# EAGLE schematic P1R5 (EAGLE 7.2.0)
DATABASE: E:/git/clay/Eagle/clayParts_bom-ex.txt

## Sheet 1 of 6
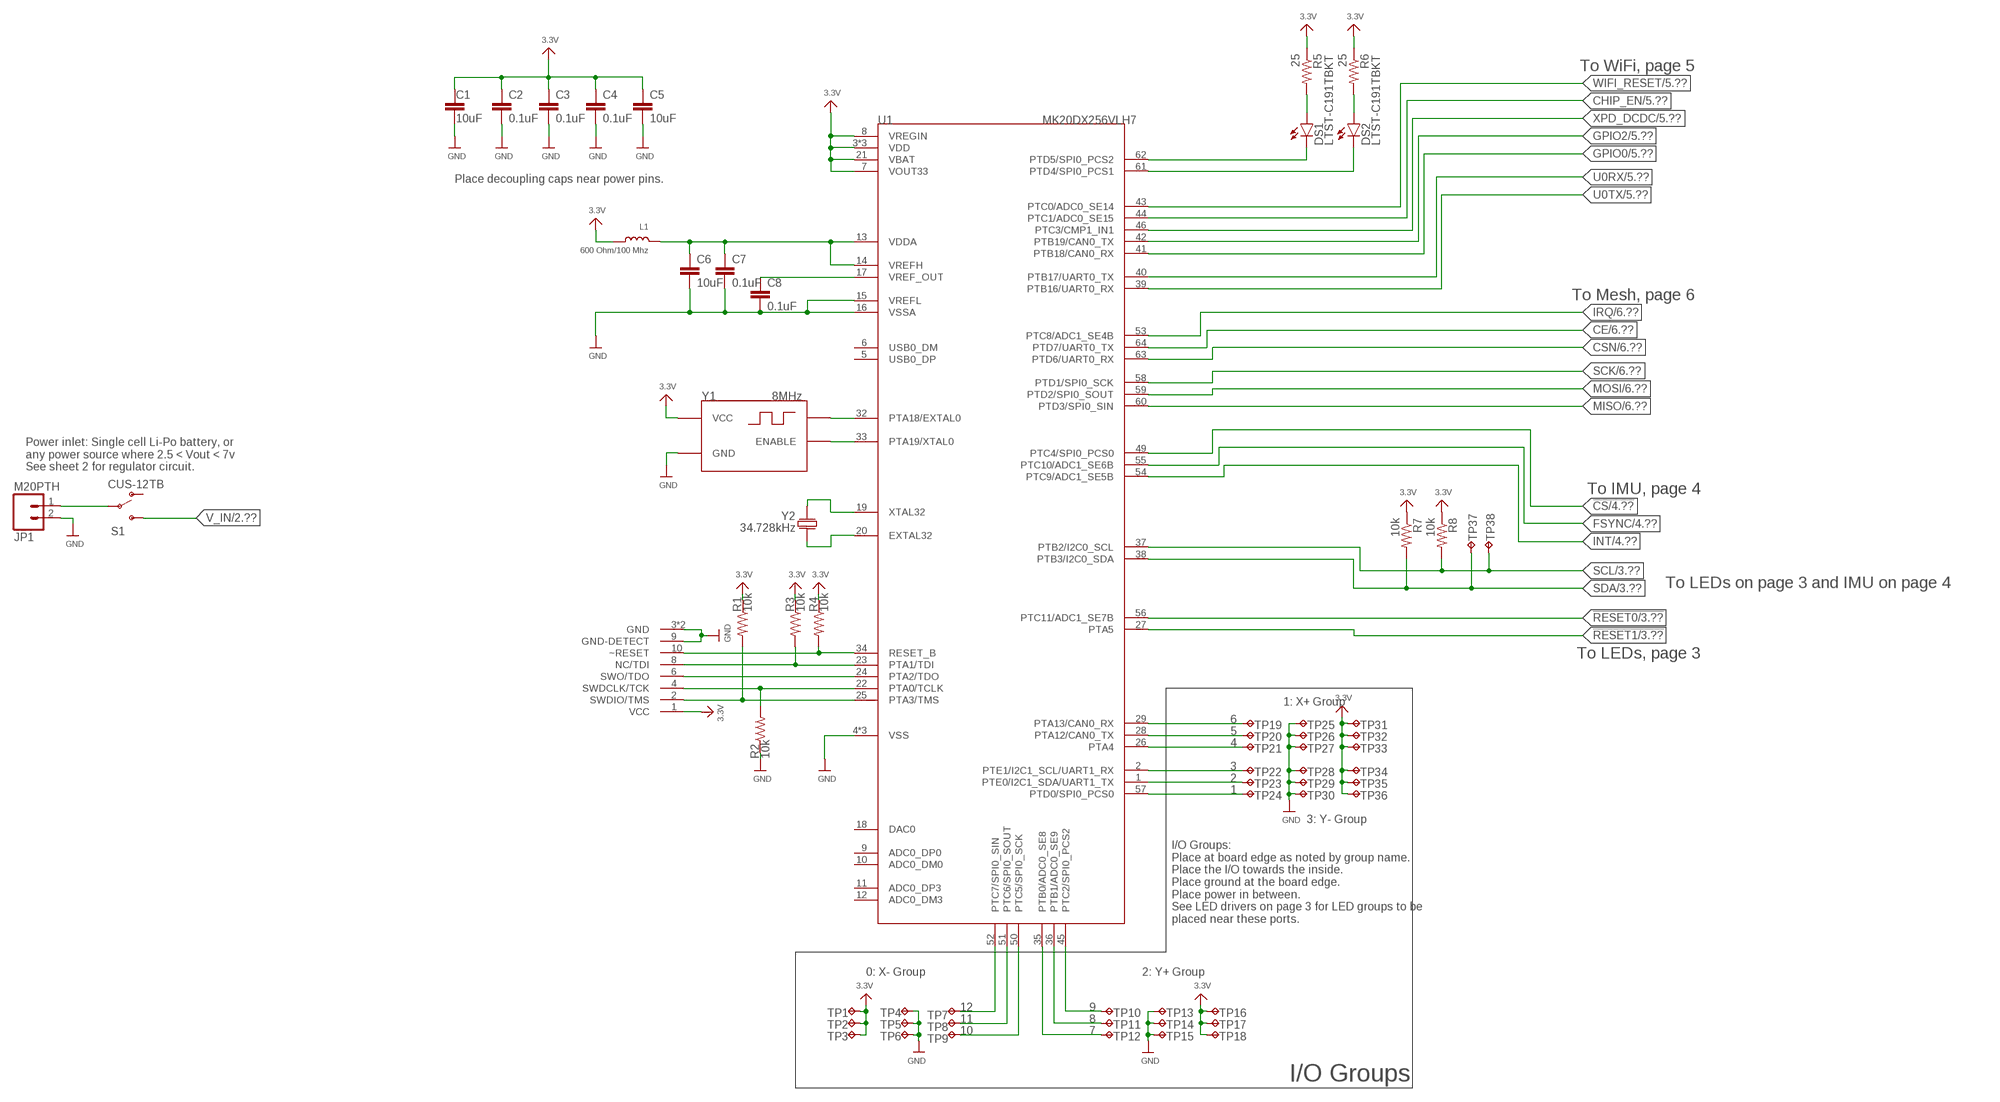
[diagram p0: schematic, sheet 1]

### Parts
C1  10uF  CAP0603-CAP  [0603-CAP]
C2  0.1uF  CAP0402-CAP  [0402-CAP]
C3  0.1uF  CAP0402-CAP  [0402-CAP]
C4  0.1uF  CAP0402-CAP  [0402-CAP]
C5  10uF  CAP0603-CAP  [0603-CAP]
C6  10uF  CAP0603-CAP  [0603-CAP]
C7  0.1uF  CAP0402-CAP  [0402-CAP]
C8  0.1uF  CAP0402-CAP  [0402-CAP]
DS1  LTST-C191TBKT  LED-GREEN  [LED-0603]
DS2  LTST-C191TBKT  LED-GREEN  [LED-0603]
J1  2X5_0.05"_CORTEX_DEBUGTH_NOKEY_UNSHROUDED  [2X5_0.05"_TH_NS]
JP1  M20PTH  M02PTH  [JST_2PIN]
L1  600 Ohm/100 Mhz  INDUCTOR-BK2125HM601-T  [0805]
R1  10k  RESISTOR0402  [_0402]
R2  10k  RESISTOR0402  [_0402]
R3  10k  RESISTOR0402  [_0402]
R4  10k  RESISTOR0402  [_0402]
R5  25  RESISTOR0402  [_0402]
R6  25  RESISTOR0402  [_0402]
R7  10k  RESISTOR0402  [_0402]
R8  10k  RESISTOR0402  [_0402]
S1  CUS-12TB  SWITCH-SPDT-SMD-A  [SWITCH-SPST-SMD-A]
TP1  TPPAD1-13  [P1-13]
TP2  TPPAD1-13  [P1-13]
TP3  TPPAD1-13  [P1-13]
TP4  TPPAD1-13  [P1-13]
TP5  TPPAD1-13  [P1-13]
TP6  TPPAD1-13  [P1-13]
TP7  TPPAD1-13  [P1-13]
TP8  TPPAD1-13  [P1-13]
TP9  TPPAD1-13  [P1-13]
TP10  TPPAD1-13  [P1-13]
TP11  TPPAD1-13  [P1-13]
TP12  TPPAD1-13  [P1-13]
TP13  TPPAD1-13  [P1-13]
TP14  TPPAD1-13  [P1-13]
TP15  TPPAD1-13  [P1-13]
TP16  TPPAD1-13  [P1-13]
TP17  TPPAD1-13  [P1-13]
TP18  TPPAD1-13  [P1-13]
TP19  TPPAD1-13  [P1-13]
TP20  TPPAD1-13  [P1-13]
TP21  TPPAD1-13  [P1-13]
TP22  TPPAD1-13  [P1-13]
TP23  TPPAD1-13  [P1-13]
TP24  TPPAD1-13  [P1-13]
TP25  TPPAD1-13  [P1-13]
TP26  TPPAD1-13  [P1-13]
TP27  TPPAD1-13  [P1-13]
TP28  TPPAD1-13  [P1-13]
TP29  TPPAD1-13  [P1-13]
TP30  TPPAD1-13  [P1-13]
TP31  TPPAD1-13  [P1-13]
TP32  TPPAD1-13  [P1-13]
TP33  TPPAD1-13  [P1-13]
TP34  TPPAD1-13  [P1-13]
TP35  TPPAD1-13  [P1-13]
TP36  TPPAD1-13  [P1-13]
TP37  TPTP08R  [TP08R]
TP38  TPTP08R  [TP08R]
U1  MK20DX256VLH7  [MK20DX256VLH7]
Y1  8MHz  ASCO.063X.047  [ASCO]
Y2  34.728kHz  ABS06ABS06_.079X.047  [ABS06]

### Nets
3.3V: C1.1 C2.1 C3.1 C4.1 C5.1 J1.1(VCC) L1.2 R1.1 R3.1 R4.1 R5.1 R6.1 R7.1 R8.1 TP1.TP TP2.TP TP3.TP TP16.TP TP17.TP TP18.TP TP31.TP TP32.TP TP33.TP TP34.TP TP35.TP TP36.TP U1.3(VDD) U1.7(VOUT33) U1.8(VREGIN) U1.21(VBAT) U1.30(VDD) U1.48(VDD) Y1.VCC ; also sheet 2,3,4,5,6
!CS: U1.49(PTC4/SPI0_PCS0) ; also sheet 4
!RESET0: U1.56(PTC11/ADC1_SE7B) ; also sheet 3
!RESET1: U1.27(PTA5) ; also sheet 3
CE: U1.64(PTD7/UART0_TX) ; also sheet 6
CHIP_EN: U1.44(PTC1/ADC0_SE15) ; also sheet 5
CSN: U1.63(PTD6/UART0_RX) ; also sheet 6
FSYNC: U1.55(PTC10/ADC1_SE6B) ; also sheet 4
GND [Top GND Pour]: C1.2 C2.2 C3.2 C4.2 C5.2 C6.2 C7.2 C8.2 J1.3(GND) J1.5(GND) J1.9(GND-DETECT) JP1.2 R2.1 TP4.TP TP5.TP TP6.TP TP13.TP TP14.TP TP15.TP TP25.TP TP26.TP TP27.TP TP28.TP TP29.TP TP30.TP U1.4(VSS) U1.15(VREFL) U1.16(VSSA) U1.31(VSS) U1.47(VSS) Y1.GND ; also sheet 2,3,4,5,6
GPIO0: U1.41(PTB18/CAN0_RX) ; also sheet 5
GPIO2: U1.42(PTB19/CAN0_TX) ; also sheet 5
INT: U1.54(PTC9/ADC1_SE5B) ; also sheet 4
IRQ: U1.53(PTC8/ADC1_SE4B) ; also sheet 6
MISO: U1.60(PTD3/SPI0_SIN) ; also sheet 6
MOSI: U1.59(PTD2/SPI0_SOUT) ; also sheet 6
N$1: U1.32(PTA18/EXTAL0) Y1.OUT
N$2: U1.33(PTA19/XTAL0) Y1.ENABLE
N$5: TP7.TP U1.52(PTC7/SPI0_SIN)
N$6: TP8.TP U1.51(PTC6/SPI0_SOUT)
N$7: DS1.A R5.2
N$8: U1.19(XTAL32) Y2.P$2
N$9: U1.20(EXTAL32) Y2.P$1
N$10: DS1.C U1.62(PTD5/SPI0_PCS2)
N$11: TP9.TP U1.50(PTC5/SPI0_SCK)
N$12: TP10.TP U1.45(PTC2/SPI0_PCS2)
N$13: DS2.C U1.61(PTD4/SPI0_PCS1)
N$14: TP11.TP U1.36(PTB1/ADC0_SE9)
N$15: TP12.TP U1.35(PTB0/ADC0_SE8)
N$16: TP24.TP U1.57(PTD0/SPI0_PCS0)
N$17: TP21.TP U1.26(PTA4)
N$18: TP22.TP U1.2(PTE1/I2C1_SCL/UART1_RX)
N$19: TP23.TP U1.1(PTE0/I2C1_SDA/UART1_TX)
N$20: TP19.TP U1.29(PTA13/CAN0_RX)
N$21: TP20.TP U1.28(PTA12/CAN0_TX)
N$29: DS2.A R6.2
N$104: JP1.1 S1.2(P)
PTA0: J1.4(SWDCLK/TCK) R2.2 U1.22(PTA0/TCLK)
PTA1: J1.8(NC/TDI) R3.2 U1.23(PTA1/TDI)
PTA2: J1.6(SWO/TDO) U1.24(PTA2/TDO)
PTA3: J1.2(SWDIO/TMS) R1.2 U1.25(PTA3/TMS)
RESET_B: J1.10(~RESET) R4.2 U1.34(RESET_B)
SCK: U1.58(PTD1/SPI0_SCK) ; also sheet 6
SCL: R8.2 TP38.TP U1.37(PTB2/I2C0_SCL) ; also sheet 3,4
SDA: R7.2 TP37.TP U1.38(PTB3/I2C0_SDA) ; also sheet 3,4
U0RX: U1.40(PTB17/UART0_TX) ; also sheet 5
U0TX: U1.39(PTB16/UART0_RX) ; also sheet 5
V_IN [Top GND Pour]: S1.3(S) ; also sheet 2
VDDA: C6.1 C7.1 L1.1 U1.13(VDDA) U1.14(VREFH)
VREF_OUT: C8.1 U1.17(VREF_OUT)
WIFI_RESET: U1.43(PTC0/ADC0_SE14) ; also sheet 5
XPD_DCDC: U1.46(PTC3/CMP1_IN1) ; also sheet 5
Unconnected: S1.1(O) U1.5(USB0_DP) U1.6(USB0_DM) U1.9(ADC0_DP0) U1.10(ADC0_DM0) U1.11(ADC0_DP3) U1.12(ADC0_DM3) U1.18(DAC0)

### Notes on the sheet
- To WiFi, page 5
- Place decoupling caps near power pins.
- To Mesh, page 6
- Power inlet: Single cell Li-Po battery, or 
  any power source where 2.5 < Vout < 7v
  See sheet 2 for regulator circuit.
- To IMU, page 4
- To LEDs on page 3 and IMU on page 4
- To LEDs, page 3
- 1: X+ Group
- 6
- 5
- 4
- 3
- 2
- 1
- 3: Y- Group
- I/O Groups:
  Place at board edge as noted by group name.
  Place the I/O towards the inside.
  Place ground at the board edge.
  Place power in between.
  See LED drivers on page 3 for LED groups to be 
  placed near these ports.
- 0: X- Group | 2: Y+ Group
- 12 | 9
- 11 | 8
- 10 | 7
- I/O Groups

## Sheet 2 of 6
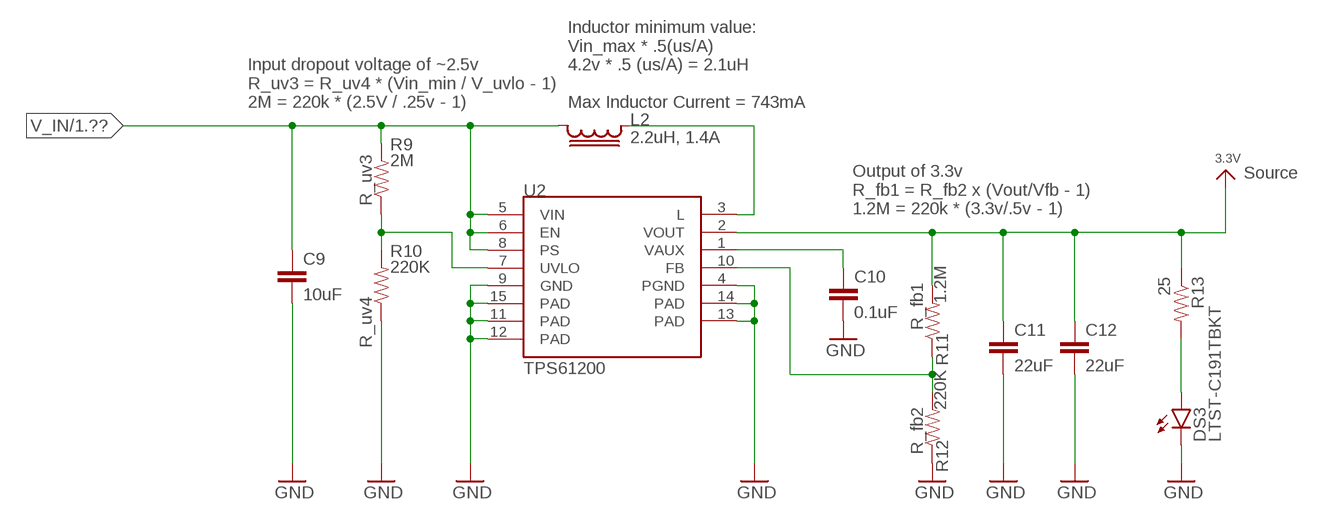
[diagram p1: schematic, sheet 2]

### Parts
C9  10uF  CAP0603-CAP  [0603-CAP]
C10  0.1uF  CAP0402-CAP  [0402-CAP]
C11  22uF  CAP1210  [1210]
C12  22uF  CAP1210  [1210]
DS3  LTST-C191TBKT  LED-GREEN  [LED-0603]
L2  2.2uH, 1.4A  LPS30152.2UH  [LPS3015]
R9  2M  RESISTOR0402  [_0402]
R10  220K  RESISTOR0402  [_0402]
R11  1.2M  RESISTOR0402  [_0402]
R12  220K  RESISTOR0402  [_0402]
R13  25  RESISTOR0402  [_0402]
U2  TPS61200  [QFN-10_PAD]

### Nets
3.3V: C11.1 C12.1 R11.2 R13.1 U2.2(VOUT) ; also sheet 1,3,4,5,6
GND [Top GND Pour]: C9.2 C10.2 C11.2 C12.2 DS3.C R10.1 R12.1 U2.4(PGND) U2.9(GND) U2.11(PAD) U2.12(PAD) U2.13(PAD) U2.14(PAD) U2.15(PAD) ; also sheet 1,3,4,5,6
N$24 [Top GND Pour]: L2.1 U2.3(L)
N$25: C10.1 U2.1(VAUX)
N$26: R9.1 R10.2 U2.7(UVLO)
N$27: R11.1 R12.2 U2.10(FB)
N$28: DS3.A R13.2
V_IN [Top GND Pour]: C9.1 L2.2 R9.2 U2.5(VIN) U2.6(EN) U2.8(PS) ; also sheet 1

### Notes on the sheet
- Input dropout voltage of ~2.5v
  R_uv3 = R_uv4 * (Vin_min / V_uvlo - 1)
  2M = 220k * (2.5V / .25v - 1)
- Inductor minimum value:
  Vin_max * .5(us/A)
  4.2v * .5 (us/A) = 2.1uH
  
  Max Inductor Current = 743mA
- Source
- R_uv3
- Output of 3.3v
  R_fb1 = R_fb2 x (Vout/Vfb - 1)
  1.2M = 220k * (3.3v/.5v - 1)
- R_fb1
- R_uv4
- R_fb2

## Sheet 3 of 6
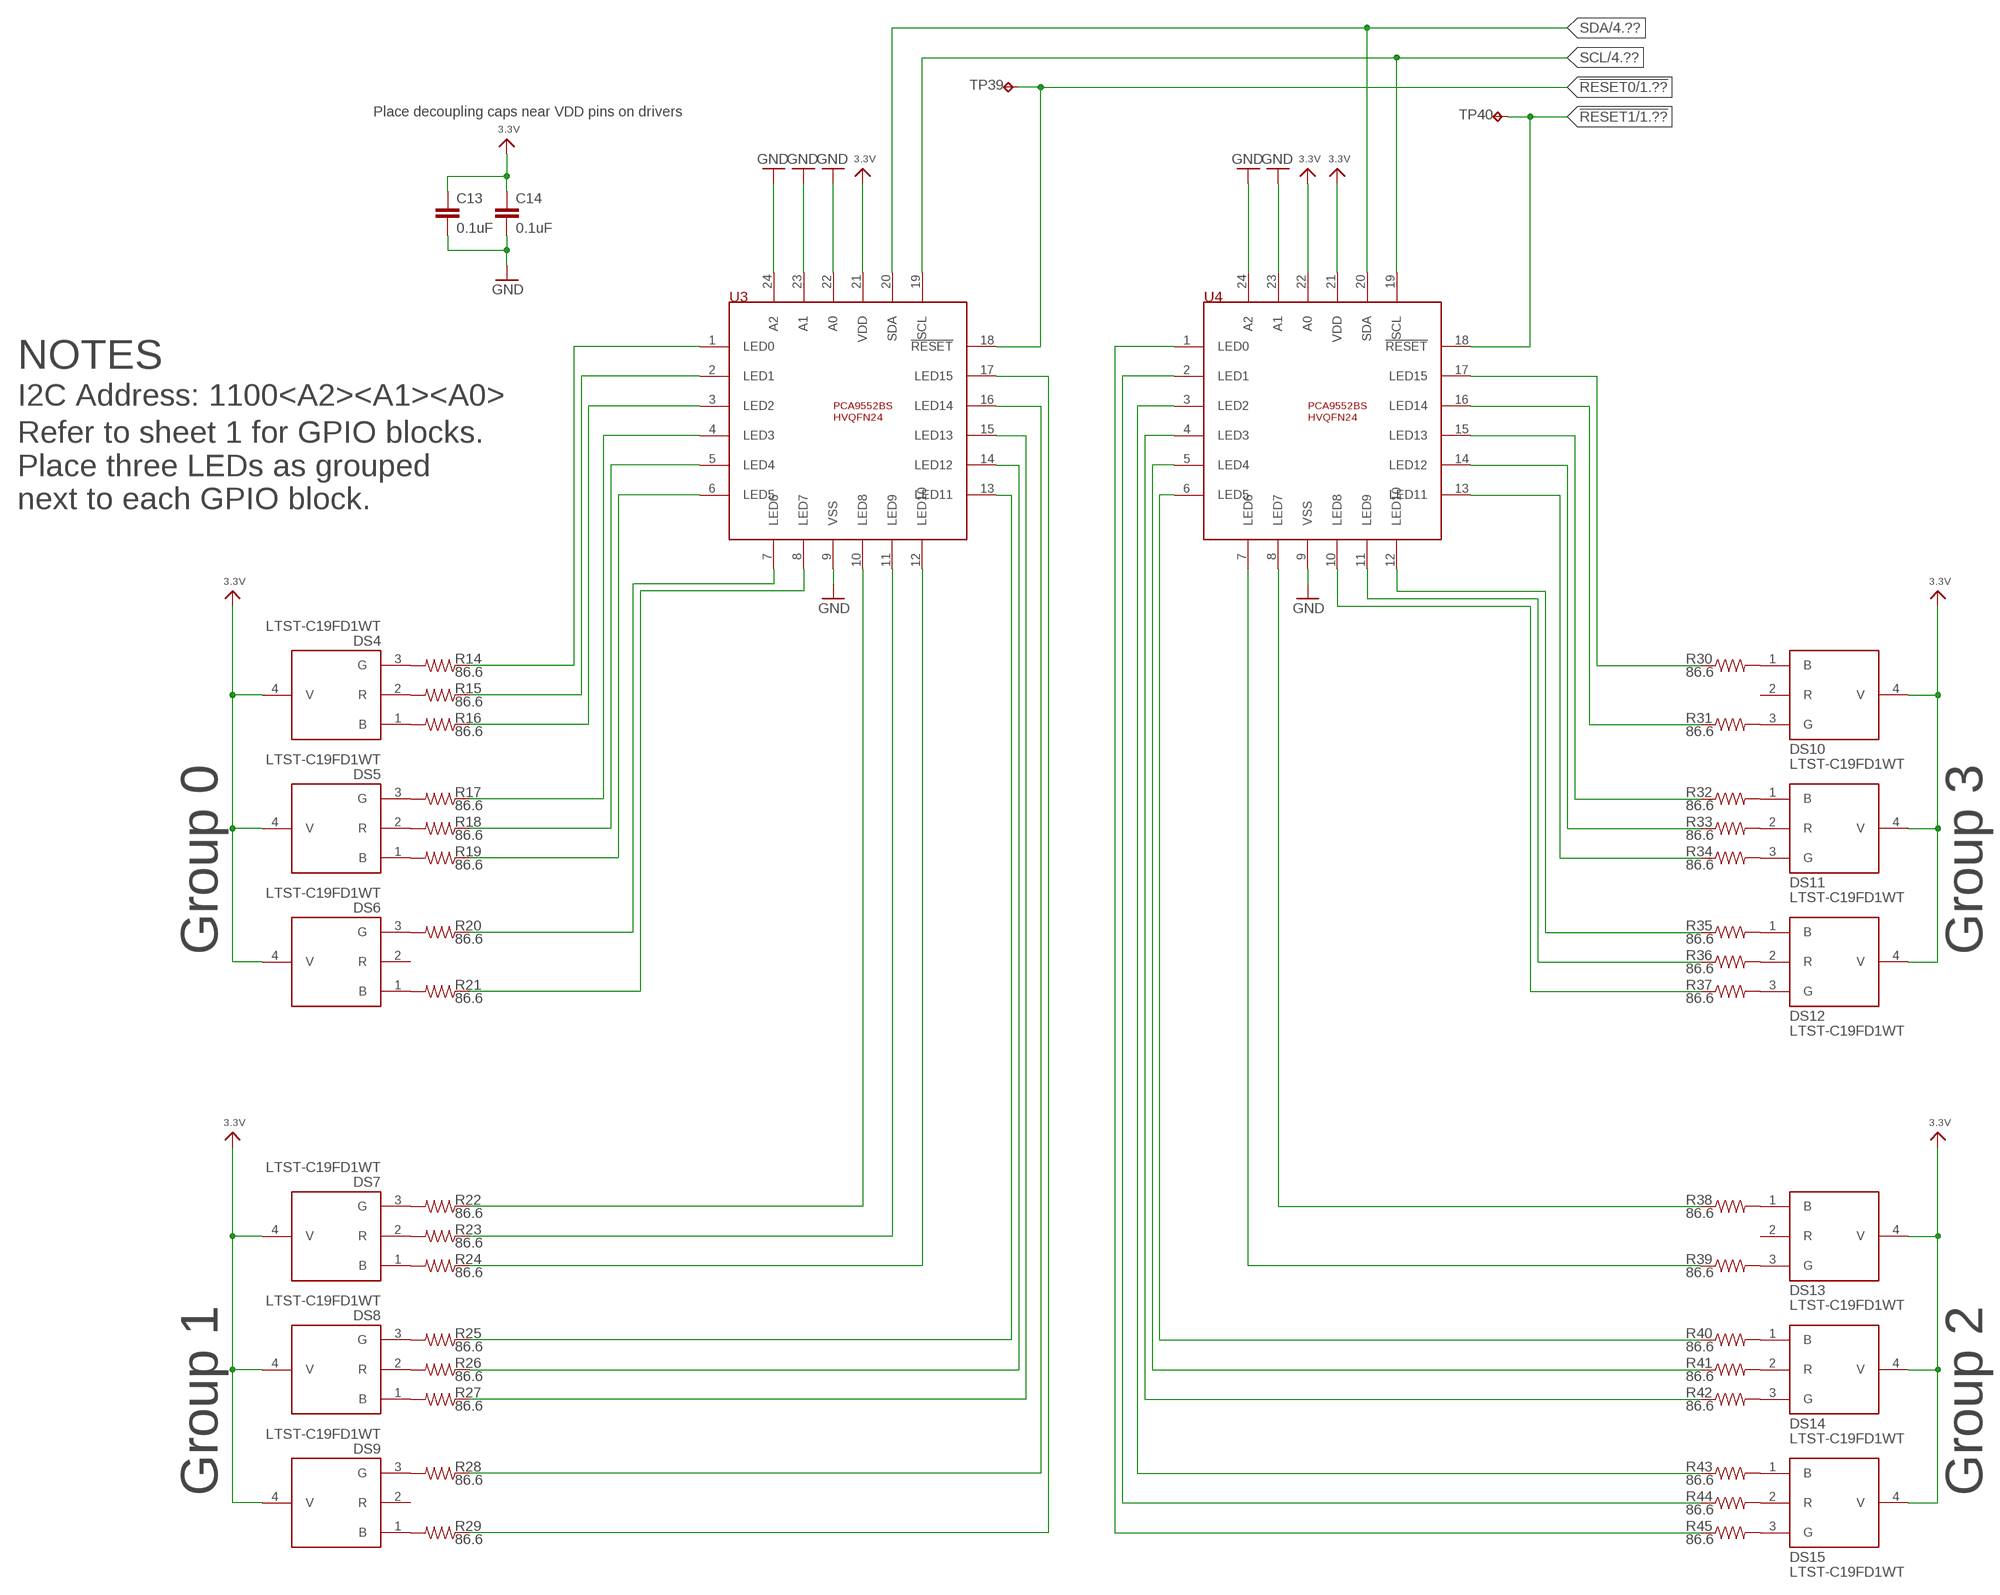
[diagram p2: schematic, sheet 3]

### Parts
C13  0.1uF  CAP0402-CAP  [0402-CAP]
C14  0.1uF  CAP0402-CAP  [0402-CAP]
DS4  LTST-C19FD1WT  [LTST-C19FD1WT]
DS5  LTST-C19FD1WT  [LTST-C19FD1WT]
DS6  LTST-C19FD1WT  [LTST-C19FD1WT]
DS7  LTST-C19FD1WT  [LTST-C19FD1WT]
DS8  LTST-C19FD1WT  [LTST-C19FD1WT]
DS9  LTST-C19FD1WT  [LTST-C19FD1WT]
DS10  LTST-C19FD1WT  [LTST-C19FD1WT]
DS11  LTST-C19FD1WT  [LTST-C19FD1WT]
DS12  LTST-C19FD1WT  [LTST-C19FD1WT]
DS13  LTST-C19FD1WT  [LTST-C19FD1WT]
DS14  LTST-C19FD1WT  [LTST-C19FD1WT]
DS15  LTST-C19FD1WT  [LTST-C19FD1WT]
R14  86.6  RESISTOR0402  [_0402]
R15  86.6  RESISTOR0402  [_0402]
R16  86.6  RESISTOR0402  [_0402]
R17  86.6  RESISTOR0402  [_0402]
R18  86.6  RESISTOR0402  [_0402]
R19  86.6  RESISTOR0402  [_0402]
R20  86.6  RESISTOR0402  [_0402]
R21  86.6  RESISTOR0402  [_0402]
R22  86.6  RESISTOR0402  [_0402]
R23  86.6  RESISTOR0402  [_0402]
R24  86.6  RESISTOR0402  [_0402]
R25  86.6  RESISTOR0402  [_0402]
R26  86.6  RESISTOR0402  [_0402]
R27  86.6  RESISTOR0402  [_0402]
R28  86.6  RESISTOR0402  [_0402]
R29  86.6  RESISTOR0402  [_0402]
R30  86.6  RESISTOR0402  [_0402]
R31  86.6  RESISTOR0402  [_0402]
R32  86.6  RESISTOR0402  [_0402]
R33  86.6  RESISTOR0402  [_0402]
R34  86.6  RESISTOR0402  [_0402]
R35  86.6  RESISTOR0402  [_0402]
R36  86.6  RESISTOR0402  [_0402]
R37  86.6  RESISTOR0402  [_0402]
R38  86.6  RESISTOR0402  [_0402]
R39  86.6  RESISTOR0402  [_0402]
R40  86.6  RESISTOR0402  [_0402]
R41  86.6  RESISTOR0402  [_0402]
R42  86.6  RESISTOR0402  [_0402]
R43  86.6  RESISTOR0402  [_0402]
R44  86.6  RESISTOR0402  [_0402]
R45  86.6  RESISTOR0402  [_0402]
TP39  TPTP08R  [TP08R]
TP40  TPTP08R  [TP08R]
U3  PCA9552BS  [HVQFN24]
U4  PCA9552BS  [HVQFN24]

### Nets
3.3V: C13.1 C14.1 DS4.4(V) DS5.4(V) DS6.4(V) DS7.4(V) DS8.4(V) DS9.4(V) DS10.4(V) DS11.4(V) DS12.4(V) DS13.4(V) DS14.4(V) DS15.4(V) U3.21(VDD) U4.21(VDD) U4.22(A0) ; also sheet 1,2,4,5,6
!RESET0: TP39.TP U3.18(!RESET) ; also sheet 1
!RESET1: TP40.TP U4.18(!RESET) ; also sheet 1
GND [Top GND Pour]: C13.2 C14.2 U3.9(VSS) U3.22(A0) U3.23(A1) U3.24(A2) U4.9(VSS) U4.23(A1) U4.24(A2) ; also sheet 1,2,4,5,6
N$36: DS8.2(R) R26.2
N$37: DS7.2(R) R23.2
N$38: DS7.1(B) R24.2
N$39: DS7.3(G) R22.2
N$40: DS8.1(B) R27.2
N$41: DS8.3(G) R25.2
N$42: DS10.3(G) R31.2
N$43: DS10.1(B) R30.2
N$44: DS9.1(B) R29.2
N$45: DS9.3(G) R28.2
N$46: R14.1 U3.1(LED0)
N$47: DS5.2(R) R18.2
N$48: R15.1 U3.2(LED1)
N$49: R16.1 U3.3(LED2)
N$50: DS14.1(B) R40.2
N$51: DS4.2(R) R15.2
N$52: DS11.2(R) R33.2
N$53: DS4.1(B) R16.2
N$54: DS4.3(G) R14.2
N$55: DS5.1(B) R19.2
N$56: DS5.3(G) R17.2
N$57: DS15.3(G) R45.2
N$58: DS12.1(B) R35.2
N$59: DS13.3(G) R39.2
N$60: R17.1 U3.4(LED3)
N$61: DS11.3(G) R34.2
N$62: DS14.3(G) R42.2
N$63: DS11.1(B) R32.2
N$64: DS12.3(G) R37.2
N$65: DS6.1(B) R21.2
N$66: DS6.3(G) R20.2
N$67: DS14.2(R) R41.2
N$68: DS13.1(B) R38.2
N$69: R18.1 U3.5(LED4)
N$70: DS15.1(B) R43.2
N$71: R19.1 U3.6(LED5)
N$72: R20.1 U3.7(LED6)
N$73: R21.1 U3.8(LED7)
N$74: R22.1 U3.10(LED8)
N$75: R23.1 U3.11(LED9)
N$76: R24.1 U3.12(LED10)
N$77: R25.1 U3.13(LED11)
N$78: R26.1 U3.14(LED12)
N$79: R27.1 U3.15(LED13)
N$80: R28.1 U3.16(LED14)
N$81: R29.1 U3.17(LED15)
N$82: DS12.2(R) R36.2
N$83: DS15.2(R) R44.2
N$84: R30.1 U4.17(LED15)
N$85: R31.1 U4.16(LED14)
N$86: R32.1 U4.15(LED13)
N$87: R33.1 U4.14(LED12)
N$88: R34.1 U4.13(LED11)
N$89: R35.1 U4.12(LED10)
N$90: R36.1 U4.11(LED9)
N$91: R37.1 U4.10(LED8)
N$92: R38.1 U4.8(LED7)
N$93: R39.1 U4.7(LED6)
N$94: R40.1 U4.6(LED5)
N$95: R41.1 U4.5(LED4)
N$96: R42.1 U4.4(LED3)
N$97: R43.1 U4.3(LED2)
N$98: R44.1 U4.2(LED1)
N$99: R45.1 U4.1(LED0)
SCL: U3.19(SCL) U4.19(SCL) ; also sheet 1,4
SDA: U3.20(SDA) U4.20(SDA) ; also sheet 1,4
Unconnected: DS6.2(R) DS9.2(R) DS10.2(R) DS13.2(R)

### Notes on the sheet
- Place decoupling caps near VDD pins on drivers
- NOTES
- I2C Address: 1100<A2><A1><A0>
- Refer to sheet 1 for GPIO blocks.
  Place three LEDs as grouped 
  next to each GPIO block.
- Group 0 | Group 3
- Group 1 | Group 2

## Sheet 4 of 6
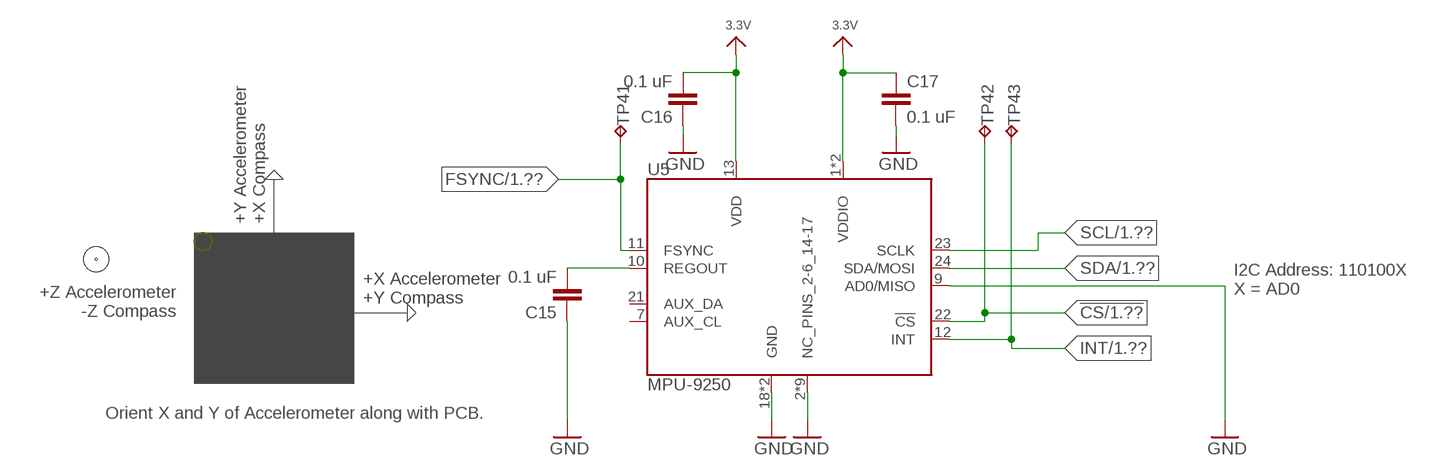
[diagram p3: schematic, sheet 4]

### Parts
C15  0.1 uF  CAP0402-CAP  [0402-CAP]
C16  0.1 uF  CAP0402-CAP  [0402-CAP]
C17  0.1 uF  CAP0402-CAP  [0402-CAP]
TP41  TPTP08R  [TP08R]
TP42  TPTP08R  [TP08R]
TP43  TPTP08R  [TP08R]
U5  MPU-9250  [QFN-24/3MM]

### Nets
3.3V: C16.2 C17.1 U5.1(VDDIO) U5.8(VDDIO) U5.13(VDD) ; also sheet 1,2,3,5,6
!CS: TP42.TP U5.22(!CS) ; also sheet 1
FSYNC: TP41.TP U5.11(FSYNC) ; also sheet 1
GND [Top GND Pour]: C15.1 C16.1 C17.2 U5.2(NC_PINS_2-6_14-17) U5.3(NC_PINS_2-6_14-17) U5.4(NC_PINS_2-6_14-17) U5.5(NC_PINS_2-6_14-17) U5.6(NC_PINS_2-6_14-17) U5.9(AD0/MISO) U5.14(NC_PINS_2-6_14-17) U5.15(NC_PINS_2-6_14-17) U5.16(NC_PINS_2-6_14-17) U5.17(NC_PINS_2-6_14-17) U5.18(GND) U5.20(GND) ; also sheet 1,2,3,5,6
INT: TP43.TP U5.12(INT) ; also sheet 1
N$4: C15.2 U5.10(REGOUT)
SCL: U5.23(SCLK) ; also sheet 1,3
SDA: U5.24(SDA/MOSI) ; also sheet 1,3
Unconnected: U5.7(AUX_CL) U5.21(AUX_DA)

### Notes on the sheet
- +Y Accelerometer
  +X Compass
- +Z Accelerometer
  -Z Compass
- I2C Address: 110100X
  X = AD0
- +X Accelerometer
  +Y Compass
- Orient X and Y of Accelerometer along with PCB.

## Sheet 5 of 6
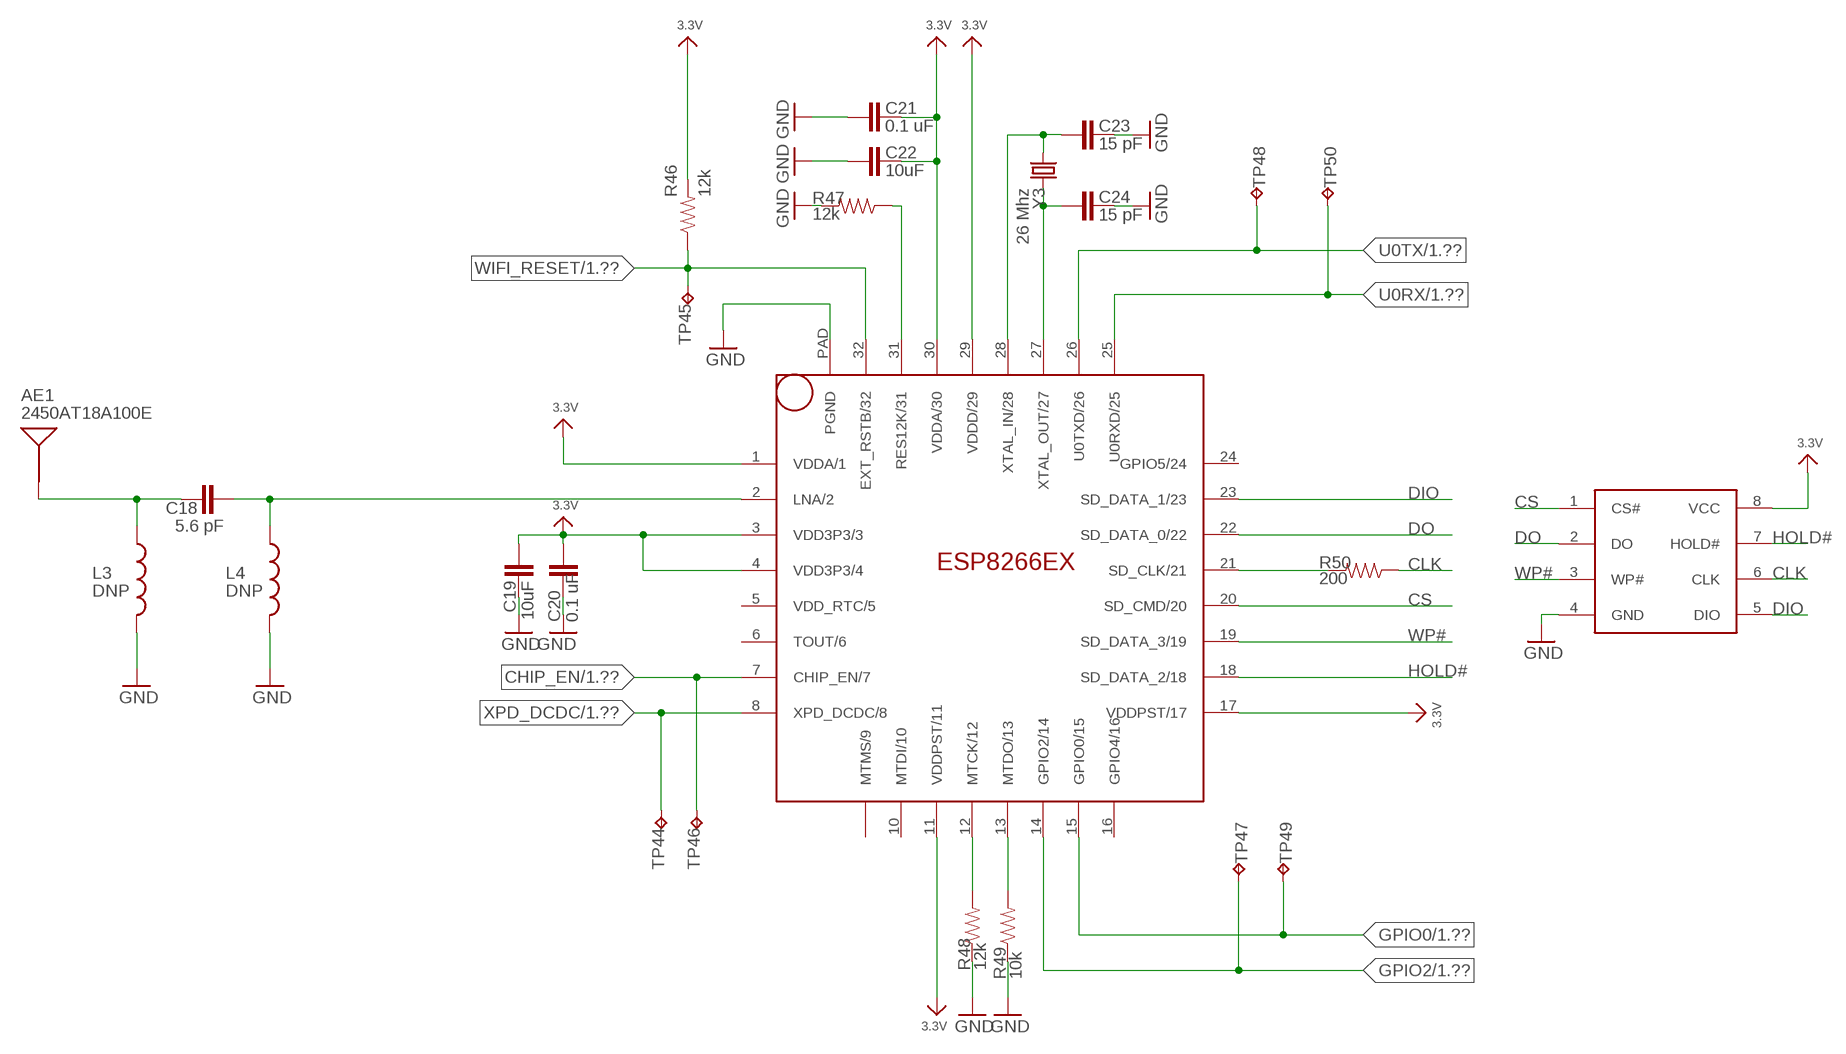
[diagram p4: schematic, sheet 5]

### Parts
AE1  2450AT18A100E  ANTENNA2SMD  [ANTENNA-CHIP2]
C18  5.6 pF  CAP0402-CAP  [0402-CAP]
C19  10uF  CAP0603-CAP  [0603-CAP]
C20  0.1 uF  CAP0402-CAP  [0402-CAP]
C21  0.1 uF  CAP0402-CAP  [0402-CAP]
C22  10uF  CAP0603-CAP  [0603-CAP]
C23  15 pF  CAP0402-CAP  [0402-CAP]
C24  15 pF  CAP0402-CAP  [0402-CAP]
L3  DNP  INDUCTOR30OHM,1.8A  [0603]
L4  DNP  INDUCTOR30OHM,1.8A  [0603]
R46  12k  RESISTOR0402  [_0402]
R47  12k  RESISTOR0402  [_0402]
R48  12k  RESISTOR0402  [_0402]
R49  10k  RESISTOR0402  [_0402]
R50  200  RESISTOR0402  [_0402]
TP44  TPTP08R  [TP08R]
TP45  TPTP08R  [TP08R]
TP46  TPTP08R  [TP08R]
TP47  TPTP08R  [TP08R]
TP48  TPTP08R  [TP08R]
TP49  TPTP08R  [TP08R]
TP50  TPTP08R  [TP08R]
U6  ESP8266EX  [QFN32]
U7  25Q40  [SOP8]
Y3  26 Mhz  CRYSTAL5X3  [CRYSTAL-SMD-5X3]

### Nets
3.3V: C19.1 C20.2 C21.1 C22.1 R46.2 U6.1(VDDA/1) U6.3(VDD3P3/3) U6.4(VDD3P3/4) U6.11(VDDPST/11) U6.17(VDDPST/17) U6.29(VDDD/29) U6.30(VDDA/30) U7.8(VCC) ; also sheet 1,2,3,4,6
CHIP_EN: TP46.TP U6.7(CHIP_EN/7) ; also sheet 1
CLK: R50.1 U7.6(CLK)
CS: U6.20(SD_CMD/20) U7.1(CS#)
DIO: U6.23(SD_DATA_1/23) U7.5(DIO)
DO: U6.22(SD_DATA_0/22) U7.2(DO)
GND [Top GND Pour]: C19.2 C20.1 C21.2 C22.2 C23.2 C24.2 L3.2 L4.2 R47.2 R48.1 R49.1 U6.PAD(PGND) U7.4(GND) ; also sheet 1,2,3,4,6
GPIO0: TP49.TP U6.15(GPIO0/15) ; also sheet 1
GPIO2: TP47.TP U6.14(GPIO2/14) ; also sheet 1
HOLD#: U6.18(SD_DATA_2/18) U7.7(HOLD#)
N$3: R50.2 U6.21(SD_CLK/21)
N$22: C18.2 L4.1 U6.2(LNA/2)
N$23: C24.1 U6.27(XTAL_OUT/27) Y3.1
N$100: C23.1 U6.28(XTAL_IN/28) Y3.3
N$101: AE1.FEED(SIGNAL) C18.1 L3.1
N$102: R48.2 U6.12(MTCK/12)
N$103: R49.2 U6.13(MTDO/13)
N$107: R47.1 U6.31(RES12K/31)
U0RX: TP50.TP U6.25(U0RXD/25) ; also sheet 1
U0TX: TP48.TP U6.26(U0TXD/26) ; also sheet 1
WIFI_RESET: R46.1 TP45.TP U6.32(EXT_RSTB/32) ; also sheet 1
WP#: U6.19(SD_DATA_3/19) U7.3(WP#)
XPD_DCDC: TP44.TP U6.8(XPD_DCDC/8) ; also sheet 1
Unconnected: U6.5(VDD_RTC/5) U6.6(TOUT/6) U6.9(MTMS/9) U6.10(MTDI/10) U6.16(GPIO4/16) U6.24(GPIO5/24)

## Sheet 6 of 6
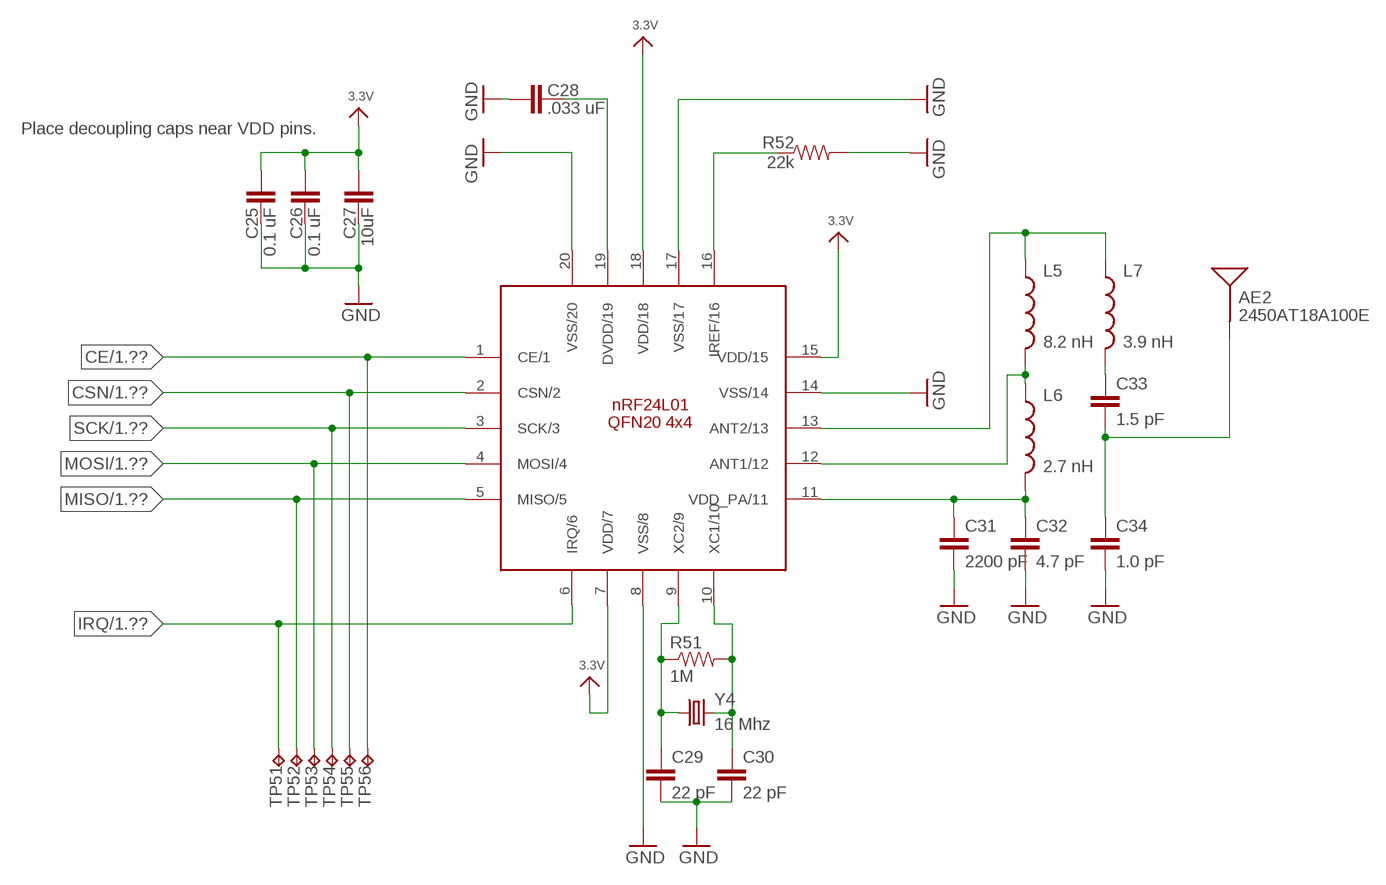
[diagram p5: schematic, sheet 6]

### Parts
AE2  2450AT18A100E  ANTENNA2SMD  [ANTENNA-CHIP2]
C25  0.1 uF  CAP0402-CAP  [0402-CAP]
C26  0.1 uF  CAP0402-CAP  [0402-CAP]
C27  10uF  CAP0603-CAP  [0603-CAP]
C28  .033 uF  CAP0402-CAP  [0402-CAP]
C29  22 pF  CAP0402-CAP  [0402-CAP]
C30  22 pF  CAP0402-CAP  [0402-CAP]
C31  2200 pF  CAP0402-CAP  [0402-CAP]
C32  4.7 pF  CAP0402-CAP  [0402-CAP]
C33  1.5 pF  CAP0402-CAP  [0402-CAP]
C34  1.0 pF  CAP0402-CAP  [0402-CAP]
L5  8.2 nH  INDUCTOR0402  [C0402]
L6  2.7 nH  INDUCTOR0402  [C0402]
L7  3.9 nH  INDUCTOR0402  [C0402]
R51  1M  RESISTOR0402  [_0402]
R52  22k  RESISTOR0402  [_0402]
TP51  TPTP08R  [TP08R]
TP52  TPTP08R  [TP08R]
TP53  TPTP08R  [TP08R]
TP54  TPTP08R  [TP08R]
TP55  TPTP08R  [TP08R]
TP56  TPTP08R  [TP08R]
U8  NRF24L01  [QFN20(4X4)]
Y4  16 Mhz  CRYSTAL5X3  [CRYSTAL-SMD-5X3]

### Nets
3.3V: C25.1 C26.1 C27.1 U8.7(VDD/7) U8.15(VDD/15) U8.18(VDD/18) ; also sheet 1,2,3,4,5
CE: TP56.TP U8.1(CE/1) ; also sheet 1
CSN: TP55.TP U8.2(CSN/2) ; also sheet 1
GND [Top GND Pour]: C25.2 C26.2 C27.2 C28.1 C29.2 C30.2 C31.2 C32.2 C34.2 R52.2 U8.8(VSS/8) U8.14(VSS/14) U8.17(VSS/17) U8.20(VSS/20) ; also sheet 1,2,3,4,5
IRQ: TP51.TP U8.6(IRQ/6) ; also sheet 1
MISO: TP52.TP U8.5(MISO/5) ; also sheet 1
MOSI: TP53.TP U8.4(MOSI/4) ; also sheet 1
N$108: C29.1 R51.1 U8.9(XC2/9) Y4.1
N$109: C30.1 R51.2 U8.10(XC1/10) Y4.3
N$111: L5.1 L7.1 U8.13(ANT2/13)
N$112: R52.1 U8.16(IREF/16)
N$113: C28.2 U8.19(DVDD/19)
N$114: L5.2 L6.1 U8.12(ANT1/12)
N$115: AE2.FEED(SIGNAL) C33.2 C34.1
N$116: C33.1 L7.2
N$117: C31.1 C32.1 L6.2 U8.11(VDD_PA/11)
SCK: TP54.TP U8.3(SCK/3) ; also sheet 1

### Notes on the sheet
- Place decoupling caps near VDD pins.

## Library data of the parts
AE1 AE2 = SparkFun-RF:ANTENNA2: Chip antenna Single endded antenna. Common with smaller chip antennas. CHIP4 package is the GPS Chip Antenna SKU: GPS-08418. CHIP5 package is 2.4GHz chip antenna SKU: WRL-00144.; PARTNO: 2450AT18A100E
C1 C5 C6 C9 C19 C22 C27 = SparkFun-Capacitors:CAP: Capacitor Standard 0603 ceramic capacitor, and 0.1" leaded capacitor.; PARTNO: C1608X7S0J106M080AC
C2-C4 C7 C8 C10 C13-C17 C20 C21 C25 C26 = SparkFun-Capacitors:CAP: Capacitor Standard 0603 ceramic capacitor, and 0.1" leaded capacitor.; PARTNO: C1005X7R1C104K050BC
C11 C12 = SparkFun-Capacitors:CAP: Capacitor Standard 0603 ceramic capacitor, and 0.1" leaded capacitor.; PARTNO: C3225X7R1A226K230AC
C18 = SparkFun-Capacitors:CAP: Capacitor Standard 0603 ceramic capacitor, and 0.1" leaded capacitor.; PARTNO: GRM1555C1H5R6CA01D
C23 C24 = SparkFun-Capacitors:CAP: Capacitor Standard 0603 ceramic capacitor, and 0.1" leaded capacitor.; PARTNO: C1005C0G1H150J050BA
C28 = SparkFun-Capacitors:CAP: Capacitor Standard 0603 ceramic capacitor, and 0.1" leaded capacitor.; PARTNO: C1005X7R1H333K050BB
C29 C30 = SparkFun-Capacitors:CAP: Capacitor Standard 0603 ceramic capacitor, and 0.1" leaded capacitor.; PARTNO: C1005C0G1H220J050BA
C31 = SparkFun-Capacitors:CAP: Capacitor Standard 0603 ceramic capacitor, and 0.1" leaded capacitor.; PARTNO: C1005X7R1H222K050BA
C32 = SparkFun-Capacitors:CAP: Capacitor Standard 0603 ceramic capacitor, and 0.1" leaded capacitor.; PARTNO: CGA2B2C0G1H4R7C050BA
C33 = SparkFun-Capacitors:CAP: Capacitor Standard 0603 ceramic capacitor, and 0.1" leaded capacitor.; PARTNO: C1005C0G1H1R5B050BA
C34 = SparkFun-Capacitors:CAP: Capacitor Standard 0603 ceramic capacitor, and 0.1" leaded capacitor.; PARTNO: C1005C0G1H010B050BA
DS1-DS3 = appfruits:LED: LEDs Standard schematic elements and footprints for 5mm, 3mm, 1206, and 0603 sized LEDs. 5mm - Spark Fun Electronics SKU : COM-00529 (and others); MF: Avago; MPN: HSMG-C190; PARTNO: LTST-C191TBKT
DS4-DS15 = led:LTST-C19FD1WT; PARTNO: LTST-C19FD1WT
J1 = con-cortex:2X5_0.05"_CORTEX_DEBUG; PARTNO: 20021111-00010T4LF
JP1 = SparkFun-Connectors:M02: Standard 2-pin 0.1" header. Use with - straight break away headers ( PRT-00116) - right angle break away headers (PRT-00553) - swiss pins (PRT-00743) - machine pins (PRT-00117) - female headers (PRT-00115) Molex polarized connector foot print use with: PRT-08233 with associated crimp pins and housings. 2.54_SCREWTERM for use with PRT-10571. 3.5mm Screw Terminal footprints for PRT-08084 5mm Screw Terminal footprints for use with PRT-08432; PARTNO: S2B-PH-K-S(LF)(SN)
L1 = appfruits:INDUCTOR: Inductors; MF: Taiyo Yuden; MPN: BK2125HM601-T; PARTNO: BK2125HM601-T
L2 = appfruits:LPS3015: Shielded Power Inductor; MF: Coilcraft; MPN: LPS3015-222MRB; PARTNO: BRL3225T2R2M; VALUE: 2.2uH, 2.1A
L3 L4 = SparkFun-Passives:INDUCTOR: Inductors; PARTNO: DNP; PROD_ID: RES-07859
L5 = SparkFun-Passives:INDUCTOR: Inductors; PARTNO: L-07C8N2JV6T
L6 = SparkFun-Passives:INDUCTOR: Inductors; PARTNO: L-07C2N7SV6T
L7 = SparkFun-Passives:INDUCTOR: Inductors; PARTNO: L-07C3N9SV6T
R1-R4 R7 R8 R49 = appfruits:RESISTOR: Resistor Basic schematic elements and footprints for 0603, 1206, and PTH resistors.; PARTNO: CRCW040210K0FKED
R5 R6 R13 = appfruits:RESISTOR: Resistor Basic schematic elements and footprints for 0603, 1206, and PTH resistors.; PARTNO: CRCW040224R9FKED
R9 = appfruits:RESISTOR: Resistor Basic schematic elements and footprints for 0603, 1206, and PTH resistors.; PARTNO: CRCW04022M00FKED
R10 R12 = appfruits:RESISTOR: Resistor Basic schematic elements and footprints for 0603, 1206, and PTH resistors.; PARTNO: CRCW0402220KFKED
R11 = appfruits:RESISTOR: Resistor Basic schematic elements and footprints for 0603, 1206, and PTH resistors.; PARTNO: CRCW04021M20FKED
R14-R45 = appfruits:RESISTOR: Resistor Basic schematic elements and footprints for 0603, 1206, and PTH resistors.; PARTNO: 5-1879213-0
R46-R48 = appfruits:RESISTOR: Resistor Basic schematic elements and footprints for 0603, 1206, and PTH resistors.; PARTNO: CRCW040212K0FKED
R50 = appfruits:RESISTOR: Resistor Basic schematic elements and footprints for 0603, 1206, and PTH resistors.; PARTNO: CRCW0402200RFKED
R51 = appfruits:RESISTOR: Resistor Basic schematic elements and footprints for 0603, 1206, and PTH resistors.; PARTNO: CRCW04021M00FKED
R52 = appfruits:RESISTOR: Resistor Basic schematic elements and footprints for 0603, 1206, and PTH resistors.; PARTNO: CRCW040222K0FKED
S1 = SparkFun-Electromechanical:SWITCH-SPDT: SPDT Switch Simple slide switch, Spark Fun Electronics SKU : COM-00102 DPDT SMT slide switch, AYZ0202, SWCH-08179; PARTNO: CUS-12TB
TP1-TP56 = testpad:TP: Test pad; PARTNO: TEST POINT
U1 = appfruits:MK20DX256VLH7; MF: Freescale; MPN: MK20DX256VLH7; PARTNO: MK20DX256VLH7
U2 = appfruits:TPS61200: DC to DC Booster IC-10035; MF: Texas Instruments; MPN: TPS61200DRCR; PARTNO: TPS61200DRCR; PROD_ID: IC-10035
U3 U4 = NXP_By_element14_Batch_1:PCA9552BS; PARTNO: PCA9552BS
U5 = chips:MPU-9250: GYRO/ACCEL/COMPASS/9-AXIS; DIGIKEY: 1428-1019-1-ND; PARTNO: MPU-9250
U6 = wifi:ESP8266EX; PARTNO: ESP8266EX
U7 = wifi:25Q40; PARTNO: 25Q40
U8 = RF:NRF24L01; PARTNO: NRF24L01P-T
Y1 = CrystalOscillators:ASCO; PARTNO: ASCO-8.000MHZ-EK-T3
Y2 = CrystalOscillators:ABS06; PARTNO: ABS06-32.768KHZ-T
Y3 = SparkFun-FreqCtrl:CRYSTAL: Various standard crystals. Proven footprints.; PARTNO: 7M-26.000MAAJ-T; PROD_ID: XTAL-08218
Y4 = SparkFun-FreqCtrl:CRYSTAL: Various standard crystals. Proven footprints.; PARTNO: 7B-16.000MAAJ-T; PROD_ID: XTAL-08218

## Net classes
1 USB: width 0.254 mm, drill 0.33 mm, clearance 0.159 mm